# EAGLE design lizard-ttl (EAGLE 6.5.0)
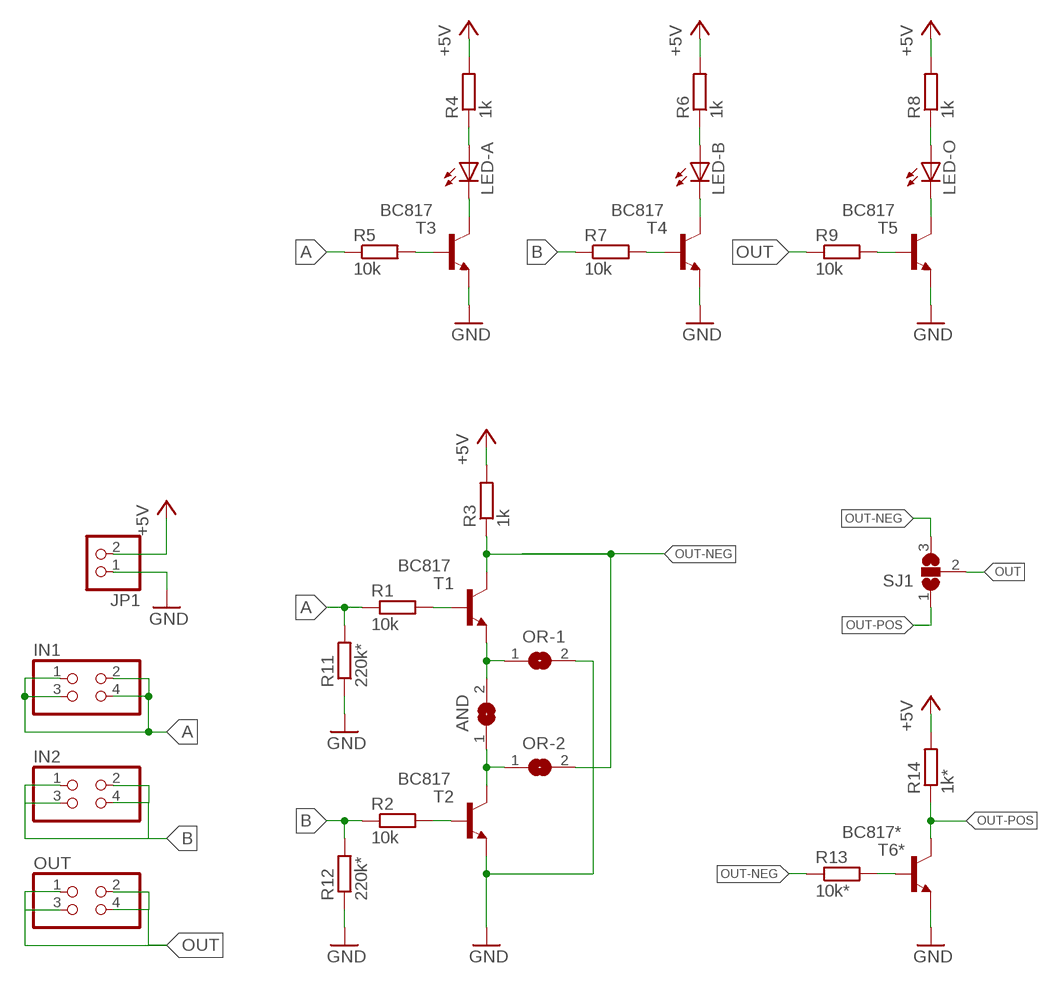
[diagram p0: schematic, sheet 1]

## Parts
AND  SJ  [SJ]
IN1  PINHD-2X2/EDGE  [2X02/EDGE]
IN2  PINHD-2X2/EDGE  [2X02/EDGE]
JP1  PINHD-1X2  [1X02]
LED-A  LEDCHIPLED_0603  [CHIPLED_0603]
LED-B  LEDCHIPLED_0603  [CHIPLED_0603]
LED-O  LEDCHIPLED_0603  [CHIPLED_0603]
OR-1  SJ  [SJ]
OR-2  SJ  [SJ]
OUT  PINHD-2X2/EDGE  [2X02/EDGE]
R1  10k  R-EU_R0603  [R0603]
R2  10k  R-EU_R0603  [R0603]
R3  1k  R-EU_R0603  [R0603]
R4  1k  R-EU_R0603  [R0603]
R5  10k  R-EU_R0603  [R0603]
R6  1k  R-EU_R0603  [R0603]
R7  10k  R-EU_R0603  [R0603]
R8  1k  R-EU_R0603  [R0603]
R9  10k  R-EU_R0603  [R0603]
R11  220k*  R-EU_R0603  [R0603]
R12  220k*  R-EU_R0603  [R0603]
R13  10k*  R-EU_R0603  [R0603]
R14  1k*  R-EU_R0603  [R0603]
SJ1  SJ2W  [SJ_2]
T1  BC817  BC817-40-NPN-SOT23-BEC  [SOT23-BEC]
T2  BC817  BC817-40-NPN-SOT23-BEC  [SOT23-BEC]
T3  BC817  BC817-40-NPN-SOT23-BEC  [SOT23-BEC]
T4  BC817  BC817-40-NPN-SOT23-BEC  [SOT23-BEC]
T5  BC817  BC817-40-NPN-SOT23-BEC  [SOT23-BEC]
T6*  BC817*  BC817-40-NPN-SOT23-BEC  [SOT23-BEC]

## Nets
+5V: JP1.2 R3.2 R4.2 R6.2 R8.2 R14.2
A: IN1.1 IN1.2 IN1.3 IN1.4 R1.1 R5.1 R11.2
B: IN2.1 IN2.2 IN2.3 IN2.4 R2.1 R7.1 R12.2
GND: JP1.1 OR-1.2 R11.1 R12.1 T2.E T3.E T4.E T5.E T6*.E
N$1: R1.2 T1.B
N$2: AND.2 OR-1.1 T1.E
N$3: R2.2 T2.B
N$4: R5.2 T3.B
N$5: LED-A.A R4.1
N$6: LED-A.C T3.C
N$7: R7.2 T4.B
N$8: LED-B.A R6.1
N$9: LED-B.C T4.C
N$10: R9.2 T5.B
N$11: LED-O.A R8.1
N$12: LED-O.C T5.C
N$13: AND.1 OR-2.1 T2.C
N$15: R13.2 T6*.B
OUT: OUT.1 OUT.2 OUT.3 OUT.4 R9.1 SJ1.2
OUT-NEG: OR-2.2 R3.1 R13.1 SJ1.3 T1.C
OUT-POS: R14.1 SJ1.1 T6*.C

## Library data of the parts
AND OR-1 OR-2 = jumper:SJ: SMD solder JUMPER
IN1 IN2 OUT = pinhead-mod:PINHD-2X2: PIN HEADER
JP1 = pinhead-mod:PINHD-1X2: PIN HEADER
LED-A LED-B LED-O = led:LED: LED OSRAM: - CHIPLED LG R971, LG N971, LY N971, LG Q971, LY Q971, LO R971, LY R971 LH N974, LH R974 LS Q976, LO Q976, LY Q976 LO Q996 - Hyper CHIPLED LW Q18S LB Q993, LB Q99A, LB R99A - SideLED LS A670, LO A670, LY A670, LG A670, LP A670 LB A673, LV A673, LT A673, LW A673 LH A674 LY A675 LS A676, LA A676, LO A676, LY A676, LW A676 LS A679, LY A679, LG A679 - Hyper Micro SIDELED® LS Y876, LA Y876, LO Y876, LY Y876 LT Y87S - SmartLED LW L88C, LW L88S LB L89C, LB L89S, LG L890 LS L89K, LO L89K, LY L89K LS L896, LA L896, LO L896, LY L896 - TOPLED LS T670, LO T670, LY T670, LG T670, LP T670 LSG T670, LSP T670, LSY T670, LOP T670, LYG T670 LG T671, LOG T671, LSG T671 LB T673, LV T673, LT T673, LW T673 LH T674 LS T676, LA T676, LO T676, LY T676, LB T676, LH T676, LSB T676, LW T676 LB T67C, LV T67C, LT T67C, LS T67K, LO T67K, LY T67K, LW E67C LS E67B, LA E67B, LO E67B, LY E67B, LB E67C, LV E67C, LT E67C LW T67C LS T679, LY T679, LG T679 LS T770, LO T770, LY T770, LG T770, LP T770 LB T773, LV T773, LT T773, LW T773 LH T774 LS E675, LA E675, LY E675, LS T675 LS T776, LA T776, LO T776, LY T776, LB T776 LHGB T686 LT T68C, LB T68C - Hyper Mini TOPLED® LB M676 - Mini TOPLED Santana® LG M470 LS M47K, LO M47K, LY M47K Source: http://www.osram.convergy.de LUXEON: - LUMILED® LXK2-PW12-R00, LXK2-PW12-S00, LXK2-PW14-U00, LXK2-PW14-V00 LXK2-PM12-R00, LXK2-PM12-S00, LXK2-PM14-U00 LXK2-PE12-Q00, LXK2-PE12-R00, LXK2-PE12-S00, LXK2-PE14-T00, LXK2-PE14-U00 LXK2-PB12-K00, LXK2-PB12-L00, LXK2-PB12-M00, LXK2-PB14-N00, LXK2-PB14-P00, LXK2-PB14-Q00 LXK2-PR12-L00, LXK2-PR12-M00, LXK2-PR14-Q00, LXK2-PR14-R00 LXK2-PD12-Q00, LXK2-PD12-R00, LXK2-PD12-S00 LXK2-PH12-R00, LXK2-PH12-S00 LXK2-PL12-P00, LXK2-PL12-Q00, LXK2-PL12-R00 Source: www.luxeon.com KINGBRIGHT: KA-3528ASYC Source: www.kingbright.com
R1-R9 R11-R14 = p.peter-rcl:R-EU_: RESISTOR, European symbol
SJ1 = jumper:SJ2W: SMD solder JUMPER
T1-T5 T6* = transistor:*-NPN-: NPN Transistror BF959 corrected 2008.03.06

## Board
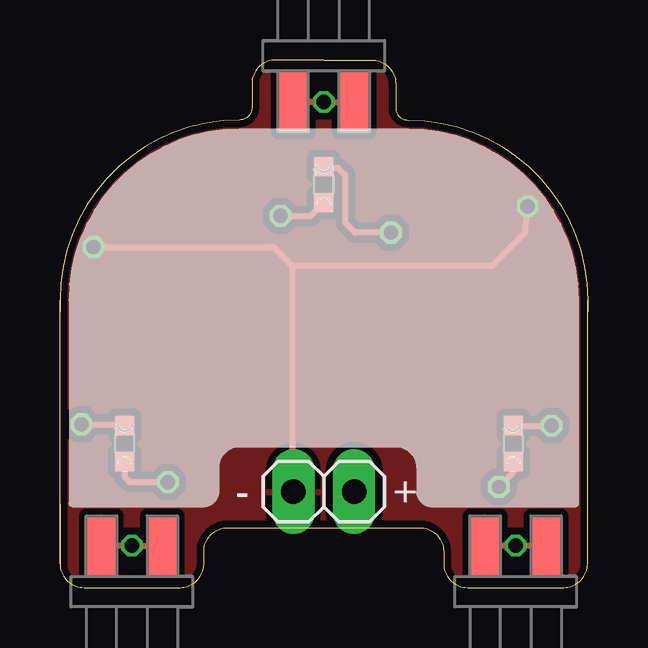
[diagram p1: board, top side]
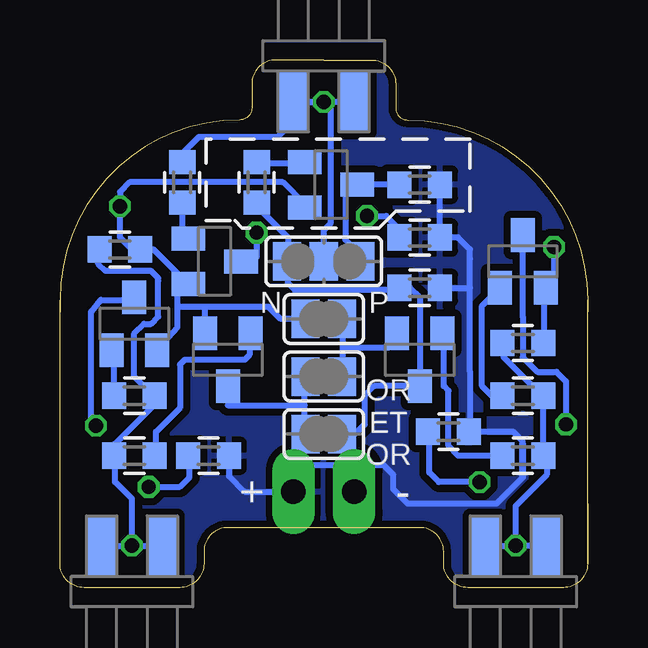
[diagram p2: board, bottom side, seen from below]

Size 22 x 22 mm. Coordinates in mm from the lower left corner, seen from the top.
Outline: 0,3.5 0,1
Outline: 0,1 arc90 1,0 5,0 arc90 6,1 6,1.5 arc-90 7,2.5 15,2.5 arc-90 16,1.5 16,1 arc90 17,0 21,0 arc90 22,1 22,11.5
Outline: 22,11.5 22,12
Outline: 22,12 arc90 14.5,19.5 arc-90 14,20 14,21 arc90 13,22 11,22 9,22 arc90 8,21 8,20 arc-90 7.5,19.5 arc90 0,12
Outline: 22,12 22,11.5
Outline: 0,1 0,11.5
Outline: 0,11.5 0,12
Outline: 0,12 0,11.5
Copper layers (1*16): Top 0.035mm / dielectric 1.5mm / Bottom 0.035mm
Design rules "Fusion_eagle_rule_v1.1 *": minimum track width 6mil, minimum drill 12mil, track to track 6mil, track to pad 6mil, pad to pad 6mil, via to via 6mil, smd to smd 0mil, copper to edge 10mil, drill to drill 10mil, minimum pad ring 15mil, minimum via ring 6mil, stop-mask expansion 2mil, vias tented up to drill 100mil, thermal gap 10mil

### Footprints (pad centres in the part's own frame; a part is rotated, then mirrored left to right if it is on the bottom)
SJ = smd 1.168 x 1.6: 1 -0.762,0; 2 0.762,0
2X02/EDGE = smd 1.27 x 2.54: 1 1.27,1.73; 3 -1.27,1.73 | smd 1.27 x 2.54 bottom: 2 1.27,1.73; 4 -1.27,1.73
1X02 = drill 1.016 long: 1 -1.27,0; 2 1.27,0
CHIPLED_0603 = smd 0.8 x 0.8: A 0,-0.75; C 0,0.75
R0603 = smd 1 x 1.1: 1 -0.85,0; 2 0.85,0
SJ_2 = smd 1.168 x 1.6: 1 -1.524,0; 2 0,0; 3 1.524,0
SOT23-BEC = smd 1 x 1.4: B -0.95,-1.1; C 0,1.1; E 0.95,-1.1

### Placement (x,y rotation side)
AND  11,8.8 0 bottom
IN1  3,0 0 top
IN2  19,0 0 top
JP1  11,4 0 top
LED-A  2.7,6 0 top
LED-B  18.9,6 0 top
LED-O  11,16.8 0 top
OR-1  11,11.2 180 bottom
OR-2  11,6.4 0 bottom
OUT  11,22 180 top
R1  2.7,5.5 180 bottom
R2  18.9,5.5 0 bottom
R3  7,12.5 0 bottom
R4  5.8,6.5 0 bottom
R5  2.7,8 180 bottom
R6  15.8,5.5 0 bottom
R7  18.9,8 180 bottom
R8  7,14.6 0 bottom
R9  16.9,16.9 270 bottom
R11  2.7,10.2 180 bottom
R12  19.5,14.1 180 bottom
R13  13.8,16.9 90 bottom
R14  7,16.8 0 bottom
SJ1  11,13.6 180 bottom
T1  7,9.5 180 bottom
T2  15,9.5 180 bottom
T3  2.7,13.6 0 bottom
T4  18.9,11 0 bottom
T5  15.55,13.6 270 bottom
T6*  10.7,16.8 270 bottom
U$1  [LOGO-JUSTGEEK-XS-MASK]  18.8,11 0 top
U$2  [LOGO-JUSTGEEK-XS-MASK]  3.2,11 0 top

### Tracks (layer width: path | path; a pad name or v marks a point on that pad's centre or on a via)
+5V
  Bottom 0.25: 4.9,12.5 4.9,9 4.9,6.55 R4.2 | 4.9,12.5 4.9,13.7 4.9,14.1 5.4,14.6 R8.2 R14.2 | R3.2 4.9,12.5 | 12.3,3.97 JP1.2 | 2.7,4.6 3.5,3.8 3.8,3.5 7.5,3.5 8.1,4.1 8.1,4.7 8.5,5.1 12,5.1 12.3,4.8 12.3,4.03 JP1.2 | 5.25,6.9 R4.2 | R6.2 14.95,4.65 14.3,4 JP1.2 | 2.7,6 2.7,6.1 3.1,6.5 R4.2
  Bottom 0.3: 2.7,4.6 2.7,6
  pour Bottom (isolate 0.3): 0,0 22,0 22,22 0,22
A  (via drill 0.6 pad 0.4)
  Top 0.25: IN1.4 1.75,1.75 v3,1.75 4.25,1.75 IN1.2
  Bottom 0.25: R1.1 1.85,5.75 | 1.85,5.75 R5.1 | IN1.2 3.77,1.73 3.75,1.75 v3,1.75 | v3,1.75 2.75,1.75 2.25,1.75 2.23,1.73 IN1.4 1.98,1.73 2,1.75 v3,1.75 | 1.85,5.75 1.95,5.65 1.85,5.65 1.7,5.5 1.7,4.7 2.3,4.1 2.6,3.8 3,3.4 v3,1.75 | R5.1 1.9,8 1.9,8.1 | R11.2 3.55,9.95 3.5,9.9 3.5,9.6 2.3,8.4 2,8.4 2,8.15 R5.1
B  (via drill 0.6 pad 0.4)
  Top 0.25: IN2.2 19.77,1.73 19.75,1.75 v19,1.75 18.5,1.75 17.75,1.75 IN2.4
  Bottom 0.25: R7.1 18.05,7.6 18.1,7.6 19.7,6 19.8,5.9 19.8,5.55 R2.1 | 19.75,1.75 20.25,1.75 IN2.2 20.54,2 | 19.75,1.75 v19,1.75 | v19,1.75 18,1.75 17.75,1.75 IN2.4 | 19.75,1.75 v19,1.75 | 19.65,5.4 19.8,5.4 19.9,5.5 R2.1 | R7.1 18.05,8.25 18,8.3 | R7.1 18.1,8 18.9,8.8 18.9,10.6 18.5,11 18.2,11 17.9,11.3 17.9,12.8 17.9,12.9 18.2,13.2 20.1,13.2 20.4,13.5 20.4,13.95 R12.2 | 20,5.25 R2.1 | v19,1.75 19,3.7 19.7,4.4 19.7,5.45 R2.1
GND  (via drill 0.6 pad 0.4)
  Top 0.25: JP1.1 9.7,4.03 9.7,4.3 9.7,13.3 9.7,13.4 | v1.4,14.2 8.8,14.2 8.9,14.2 9.7,13.4 | v19.5,15.9 19.4,14.8 18.8,14.2 18,13.4 9.7,13.4
  Bottom 0.25: 17.65,9.9 T4.E 17.1,10.85 17.1,11.7 | 17.65,9.9 17.8,9.9 17.9,10 | 17.65,9.9 17.7,9.9 17.9,10.1 | R11.1 1.8,10.2 1.8,12.45 T3.E 1.7,12.55 1.7,12.6 1.4,12.9 v1.4,14.2 | R12.1 18.6,14.1 | 15.95,10.65 T2.E 15.95,11.65 16,11.7 | OR-1.2 12.6,11.2 12.8,11.2 13.3,11.7 16,11.7 | 16,11.7 17.1,11.7 | 17.1,11.7 17.1,12.6 | 17.1,12.6 16.7,12.6 T5.E | 17.1,12.6 17.1,13.1 18.1,14.1 R12.1 | R12.1 19,14.1 19.5,14.6 v19.5,15.9 19.5,16.5 19.1,16.9 12.7,16.9 11.8,16 T6*.E
  pour Top (isolate 0.3): 0,0 22,0 22,22 0,22
N$1
  Bottom 0.25: R1.2 3.8,5.5 5.4,5.5 5.8,5.9 5.8,8.2 6,8.4 6,10.55 T1.B 6.1,10.55
N$2
  Bottom 0.25: T1.E 7.95,10.95 8,11 8,10.3 8.3,10 10.2,10 | AND.2 10.2,8.8 10.2,10 | 10.2,10 10.2,11.16 OR-1.1
N$3
  Bottom 0.25: R2.2 18,5.5 | 18,5.5 17.9,5.5 18,5.5 | 18,5.5 18,6.5 17,7.5 17,9.3 16.8,9.5 14.3,9.5 14.1,9.7 14.1,10.6 T2.B
N$4
  Bottom 0.25: R5.2 4,8 4.4,8.4 4.4,11.75 T3.B
N$5  (via drill 0.6 pad 0.4)
  Top 0.25: LED-A.A 2.7,5.2 | LED-A.A 2.54,5.35 2.75,5.25 2.8,5.2 | 2.8,5.2 LED-A.A | 2.8,5.2 2.7,5.2 | 2.7,5.2 2.7,4.6 2.9,4.4 v4.5,4.4
  Bottom 0.25: v4.5,4.4 6.2,4.4 6.6,4.8 6.6,6.45 R4.1
N$6  (via drill 0.6 pad 0.4)
  Top 0.25: 2.7,6.8 LED-A.C 2.65,6.8 v0.9,6.8
  Bottom 0.25: T3.C 2.7,11.3 2.7,9.6 2.1,9 1.3,9 0.9,8.6 v0.9,6.8
N$7
  Bottom 0.25: R7.2 19.75,9.8 T4.B
N$8  (via drill 0.6 pad 0.4)
  Top 0.25: LED-B.A 18.9,4.8 v18.3,4.2
  Bottom 0.25: v18.3,4.2 17,4.2 16.6,4.6 16.6,5.45 R6.1
N$9  (via drill 0.6 pad 0.4)
  Top 0.25: LED-B.C v20.5,6.75
  Bottom 0.25: v20.5,6.75 20.5,6.8 20.7,7 20.7,11.5 20.3,12 19,12 T4.C
N$10
  Bottom 0.25: R9.2 16.65,16.05 16.9,16 16.9,14.6 T5.B
N$11  (via drill 0.6 pad 0.4)
  Top 0.25: 11,16.1 LED-O.A 10.45,15.5 v9.2,15.5
  Bottom 0.25: 7.8,14.6 R8.1 7.85,14.75 8,14.9 | 8,14.9 7.9,15 8.4,15.5 v9.2,15.5 | 8,14.9 7.8,14.9
N$12  (via drill 0.6 pad 0.4)
  Top 0.25: LED-O.C 11,17.8 | 11.05,17.5 LED-O.C | v13.8,14.8 12.3,14.8 11.9,15.2 11.9,17.2 11.6,17.5 11.05,17.5 | 11.05,17.5 LED-O.C
  Bottom 0.25: 15,13.6 T5.C 14,13.6 13.8,13.8 v13.8,14.8
N$13
  Bottom 0.25: T2.C 15,7.6 11.8,7.6 | 11.8,7.6 11.8,8.76 AND.1 | OR-2.1 11.8,6.4 11.8,7.6
N$15
  Bottom 0.25: R13.2 13.7,17.7 11.85,17.7 T6*.B
OUT  (via drill 0.6 pad 0.4)
  Top 0.25: OUT.2 9.75,20.25 v11,20.25 12.25,20.25 OUT.4
  Bottom 0.25: 10,20.25 10.02,20.27 9.98,20.27 | 10,20.25 9.75,20.25 OUT.2 | OUT.2 9.98,20.27 | 9.98,20.27 10,20.25 | 9.98,20.27 10,20.25 | 10,20.25 v10.99,20.25 | v10.99,20.25 v11,20.25 | OUT.4 12.25,20.25 11.75,20.25 | 11.75,20.25 v11,20.25 | OUT.4 11.77,20.27 11.75,20.25 | 11.75,20.25 v11,20.25 | v10.99,20.25 OUT.4 | 12.6,20.3 12.3,20.3 OUT.4 | 9.7,19.2 9.73,19.23 OUT.2 | R9.1 16.9,18.1 16.2,18.8 12.9,18.8 12.3,19.4 12.3,20.24 OUT.4 | SJ1.2 11,14.9 10.7,15.2 10.7,19.95 v11,20.25
OUT-NEG
  Bottom 0.25: T1.C 7,12.1 7.4,12.5 R3.1 8,12.5 8.1,12.4 12.2,12.4 12.5,12.7 12.5,13.58 SJ1.3 | T1.C 7.2,8.2 T1.C | T1.C 8.9,8.4 9.3,8 9.3,6.8 9.7,6.4 OR-2.2 | SJ1.3 12.52,14.23 | R13.1 13.7,15.8 12.5,14.6 12.5,13.62 SJ1.3
OUT-POS
  Bottom 0.25: R14.1 9.5,16.8 | 9.5,16.8 T6*.C 9.5,16.8 | 9.5,13.62 SJ1.1 9.5,13.62 | 9.5,16.8 10.1,16.8 10.1,14.5 9.5,13.9 9.5,13.62

### Text on the board
tPlace: - | +
bPlace: P | N | OR / ET / OR | - | +
tStop: lizard / v0.4 | justgeek